# Altium schematic sheet 8_LevelShifter.SchDoc
size A4; SheetNumber: 11; SheetTotal: 12
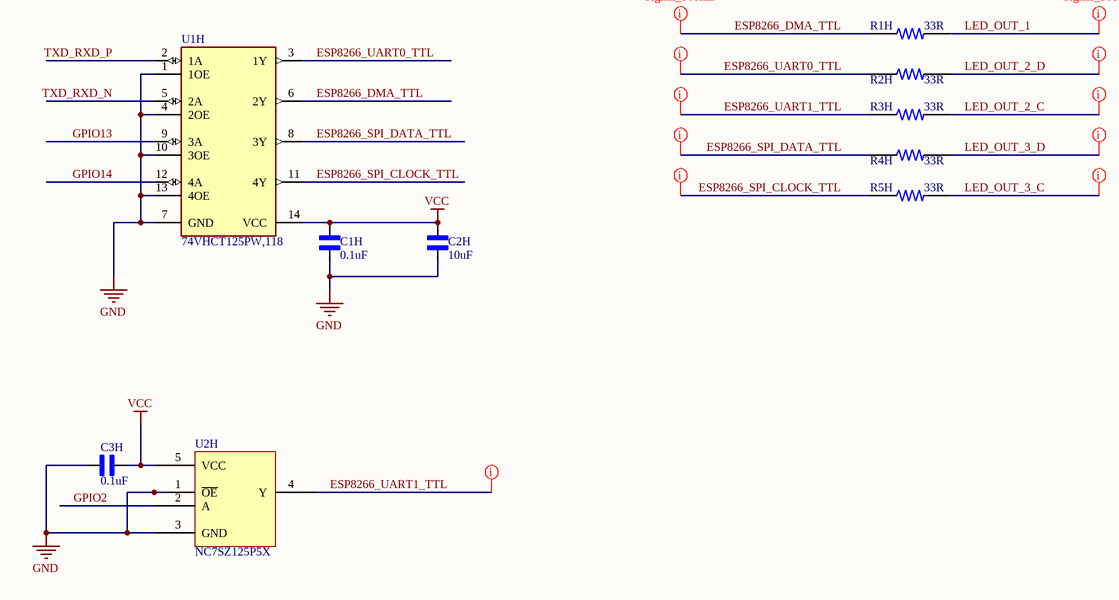
[diagram p0: 8_LevelShifter.SchDoc]

## Parts
C1H  0.1uF  [C-0603]
C2H  10uF  [C-0603]
C3H  0.1uF  [C-0603]
R1H  33R  [R-0603]
R2H  33R  [R-0603]
R3H  33R  [R-0603]
R4H  33R  [R-0603]
R5H  33R  [R-0603]
U1H  74VHCT125PW,118  [SOP65P640X110-14N]
U2H  NC7SZ125P5X  [ON SEMI SC70-5  419AC-01]

## Nets
GND: C1H.1 C2H.1 C3H.1 U1H.1(1OE) U1H.4(2OE) U1H.7(GND) U1H.10(3OE) U1H.13(4OE) U2H.1(~{OE}) U2H.3(GND)
VCC: C1H.2 C2H.2 C3H.2 U1H.14(VCC) U2H.5(VCC)
ESP8266_DMA_TTL: R1H.1 U1H.6(2Y)
ESP8266_SPI_CLOCK_TTL: R5H.1 U1H.11(4Y)
ESP8266_SPI_DATA_TTL: R4H.1 U1H.8(3Y)
ESP8266_UART0_TTL: R2H.1 U1H.3(1Y)
ESP8266_UART1_TTL: R3H.1 U2H.4(Y)
GPIO2: U2H.2(A)
GPIO13: U1H.9(3A)
GPIO14: U1H.12(4A)
LED_OUT_1: R1H.2
LED_OUT_2_C: R3H.2
LED_OUT_2_D: R2H.2
LED_OUT_3_C: R5H.2
LED_OUT_3_D: R4H.2
TXD_RXD_N: U1H.5(2A)
TXD_RXD_P: U1H.2(1A)

## Layout directives
net class Signal_50ohm: ESP8266_DMA_TTL, ESP8266_SPI_CLOCK_TTL, ESP8266_SPI_DATA_TTL, ESP8266_UART0_TTL, ESP8266_UART1_TTL, LED_OUT_1, LED_OUT_2_C, LED_OUT_2_D, LED_OUT_3_C, LED_OUT_3_D

## Library data of the parts
C1H C2H C3H = C-0603: Ceramic Capacitor 16V 0603 (1608 Metric); MP: C0603C104J4RAC; MF: KEMET; SnapEDA_Link: https://www.snapeda.com/parts/C0603C104J4RAC/KEMET/view-part/1763758/?ref=snap; Availability: Warning; Package: 0603 KEMET; Check_prices: https://www.snapeda.com/parts/C0603C104J4RAC/KEMET/view-part/1763758/?ref=eda; Value: *; Price: None
R1H R2H R3H R4H R5H = R-0603: 0603; MP: 2-1623703-0; Power_Rating: .1 W; Value: 10K; Tolerance: 1%; MF: TE Connectivity; Package: 0603; Price: None; Resistance: 10K; Check_prices: https://www.snapeda.com/parts/2-1623703-0/TE%20Connectivity/view-part/2213192/?ref=eda; SnapEDA_Link: https://www.snapeda.com/parts/2-1623703-0/TE%20Connectivity/view-part/2213192/?ref=snap; Availability: Warning
U1H = 74VHCT125PW,118: Buffer, Non-Inverting 4 Element 1 Bit per Element 3-State Output 14-SOIC; MP: 74HC125; MF: Nexperia USA; Value: *; SnapEDA_Link: https://www.snapeda.com/parts/74HC125/Nexperia%20USA%20Inc./view-part/560724/?ref=snap; Availability: Unavailable; Price: None; Package: SOIC-14 STMicroelectronics
U2H = NC7SZ125P5X: IC BUF NON-INVERT 5.5V SC70-5; Manufacturer: ON Semiconductor; Current - Output High, Low: 32mA, 32mA; Logic Type: Buffer, Non-Inverting; Number of Bits per Element: 1; Output Type: 3-State; Voltage - Supply: 1.65V ~ 5.5V; Part Number: NC7SZ125P5X; ComponentLink1Description: Datasheet; ComponentLink1URL: https://www.onsemi.com/pub/Collateral/NC7SZ125-D.PDF; ComponentLink2Description: DigiKey Link; ComponentLink2URL: //digikey.com/product-detail/en/on-semiconductor/NC7SZ125P5X/NC7SZ125P5XTR-ND/673366; Device Package: 5-TSSOP, SC-70-5, SOT-353; LastUpdated: 09-12-2019 01:20:32 AM; Lifecycle Status: 0; Minimum Order: 1; Mounting Type: Surface Mount; Number of Elements: 1; Operating Temperature: -40°C ~ 85°C (TA); Package / Case: 5-TSSOP, SC-70-5, SOT-353; Packaging: TapeAndReel; PartId: 2; Part Status: Active; Price: 0.07; Series: 7SZ; Supplier 1: DigiKey; Supplier Part Number 1: NC7SZ125P5XTR-ND; Supplier Device Package: SC-70-5